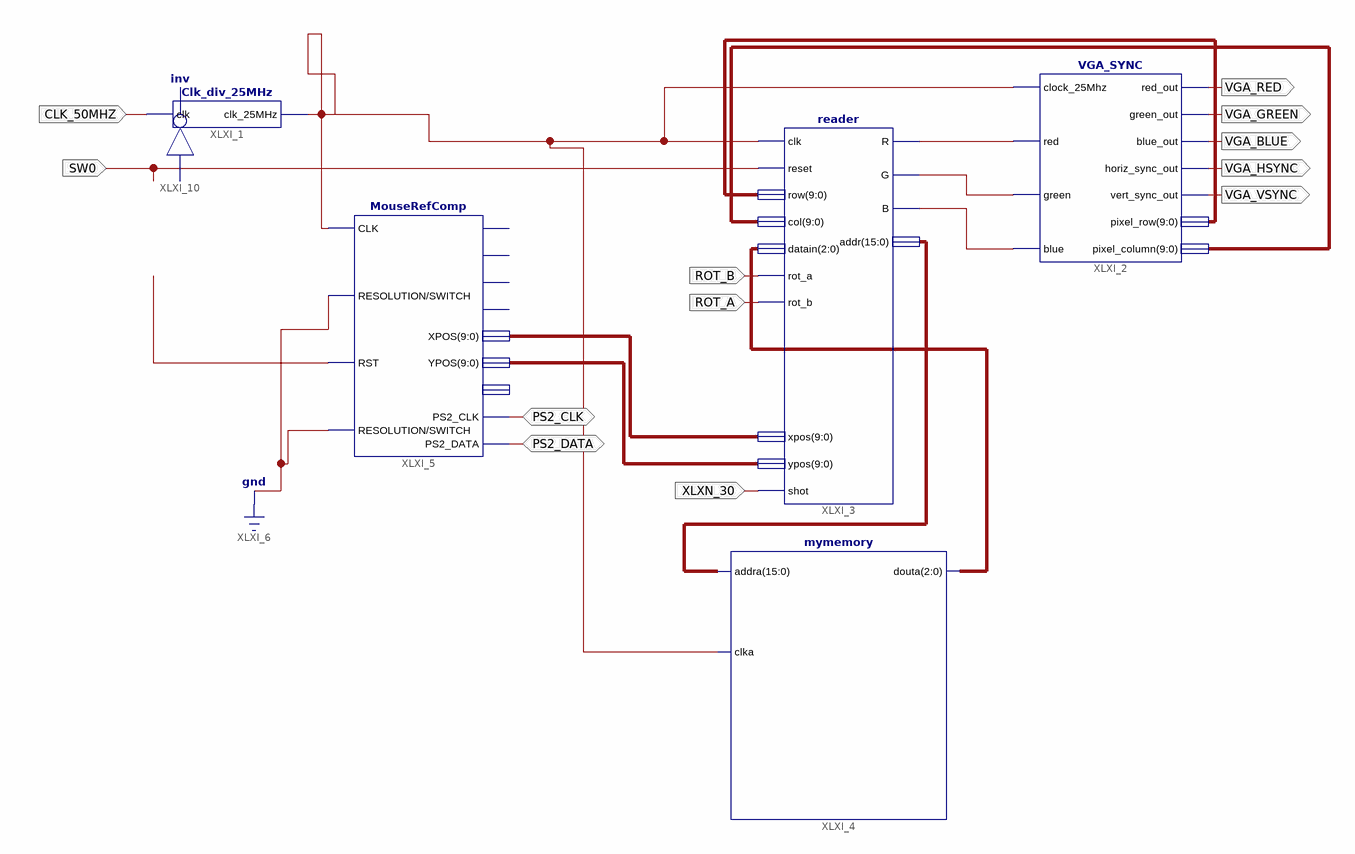
[diagram p0: schematic sheet 1]
// Xilinx ISE schematic VGA_Proyect.sch (spartan3e) as structural Verilog: 6 symbols, 12 ports
module VGA_Proyect (
  input  CLK_50MHZ,
  input  ROT_B,
  input  ROT_A,
  input  XLXN_30,
  input  SW0,
  inout  PS2_CLK,
  inout  PS2_DATA,
  output VGA_RED,
  output VGA_GREEN,
  output VGA_BLUE,
  output VGA_HSYNC,
  output VGA_VSYNC
);

  wire XLXN_9, XLXN_10, XLXN_11, XLXN_53, XLXN_56;
  wire [2:0] XLXN_17;
  wire [9:0] XLXN_12, XLXN_13, XLXN_28, XLXN_29;
  wire [15:0] XLXN_16;

  Clk_div_25MHz XLXI_1 (.clk(CLK_50MHZ), .clk_25MHz(XLXN_56));
  VGA_SYNC XLXI_2 (
    .clock_25Mhz(XLXN_56), .red(XLXN_9), .green(XLXN_10), .blue(XLXN_11), .red_out(VGA_RED),
    .green_out(VGA_GREEN), .blue_out(VGA_BLUE), .horiz_sync_out(VGA_HSYNC), .vert_sync_out(VGA_VSYNC),
    .pixel_row(XLXN_12), .pixel_column(XLXN_13));
  reader XLXI_3 (
    .clk(XLXN_56), .reset(SW0), .rot_a(ROT_B), .rot_b(ROT_A), .shot(XLXN_30), .row(XLXN_12), .col(XLXN_13),
    .datain(XLXN_17), .xpos(XLXN_28), .ypos(XLXN_29), .R(XLXN_9), .G(XLXN_10), .B(XLXN_11), .addr(XLXN_16));
  mymemory XLXI_4 (.addra(XLXN_16), .clka(XLXN_56), .douta(XLXN_17));
  MouseRefComp XLXI_5 (
    .CLK(XLXN_56), .RESOLUTION(1'b0), .RST(XLXN_53), .SWITCH(1'b0), .XPOS(XLXN_28), .YPOS(XLXN_29),
    .PS2_CLK(PS2_CLK), .PS2_DATA(PS2_DATA));  // open: LEFT, MIDDLE, NEW_EVENT, RIGHT, ZPOS
  not XLXI_10 (XLXN_53, SW0);
endmodule
